# EAGLE design main (EAGLE 9.7.0)
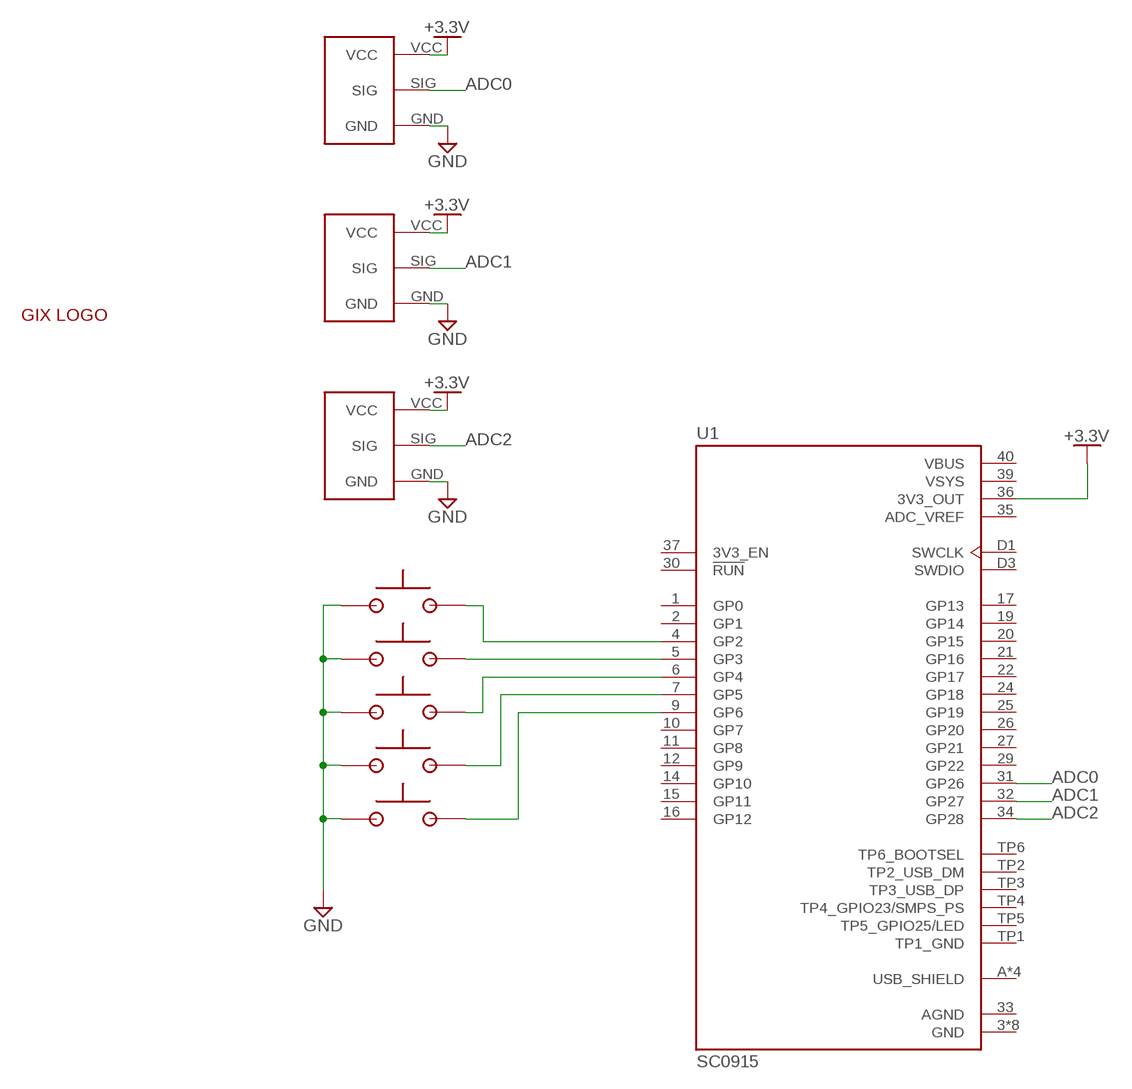
[diagram p0: schematic, sheet 1]

## Parts
U1  SC0915  [MODULE_SC0915]
U$1  TERMINAL_BLOCK  [TERMINAL_BLOCK]
U$2  TERMINAL_BLOCK  [TERMINAL_BLOCK]
U$3  TERMINAL_BLOCK  [TERMINAL_BLOCK]
U$4  TERMINAL_BLOCK  [TERMINAL_BLOCK]
U$5  TERMINAL_BLOCK  [TERMINAL_BLOCK]
U$6  3PIN_SENSOR  [TERMINAL_BLOCK_3P]
U$7  3PIN_SENSOR  [TERMINAL_BLOCK_3P]
U$8  3PIN_SENSOR  [TERMINAL_BLOCK_3P]
U$9  LOGO  [LOGO]

## Nets
+3.3V: U1.36(3V3_OUT) U$6.VCC U$7.VCC U$8.VCC
ADC0: U1.31(GP26) U$6.SIG
ADC1: U1.32(GP27) U$7.SIG
ADC2: U1.34(GP28) U$8.SIG
GND: U$1.P$1 U$2.P$1 U$3.P$1 U$4.P$1 U$5.P$1 U$6.GND U$7.GND U$8.GND
N$1: U1.6(GP4) U$3.P$2
N$2: U1.5(GP3) U$2.P$2
N$3: U1.4(GP2) U$1.P$2
N$4: U1.7(GP5) U$4.P$2
N$5: U1.9(GP6) U$5.P$2
Unconnected: U1.1(GP0) U1.2(GP1) U1.10(GP7) U1.11(GP8) U1.12(GP9) U1.14(GP10) U1.15(GP11) U1.16(GP12) U1.17(GP13) U1.19(GP14) U1.20(GP15) U1.21(GP16) U1.22(GP17) U1.24(GP18) U1.25(GP19) U1.26(GP20) U1.27(GP21) U1.29(GP22) U1.30(!RUN) U1.37(3V3_EN) U1.D1(SWCLK) U1.D3(SWDIO) U1.TP2(TP2_USB_DM) U1.TP3(TP3_USB_DP) U1.TP4(TP4_GPIO23/SMPS_PS) U1.TP5(TP5_GPIO25/LED) U1.TP6(TP6_BOOTSEL)

## Power pins joined to a net without a drawn wire
ADC_VREF: U1.35(ADC_VREF)
AGND: U1.33(AGND)
GND: U1.3(GND) U1.8(GND) U1.13(GND) U1.18(GND) U1.23(GND) U1.28(GND) U1.38(GND) U1.D2(GND)
TP1_GND: U1.TP1(TP1_GND)
USB_SHIELD: U1.A(USB_SHIELD) U1.B(USB_SHIELD) U1.C(USB_SHIELD) U1.D(USB_SHIELD)
VBUS: U1.40(VBUS)
VSYS: U1.39(VSYS)

## Library data of the parts
U1 = SC0915:SC0915; MANUFACTURER: Pi Supply; PARTREV: 1.9; SNAPEDA_PN: SC0915; STANDARD: Manufacturer Recommendations
U$1-U$5 = inputChallengeLib:TERMINAL_BLOCK
U$6-U$8 = inputChallengeLib:3PIN_SENSOR
U$9 = GIX:LOGO

## Board
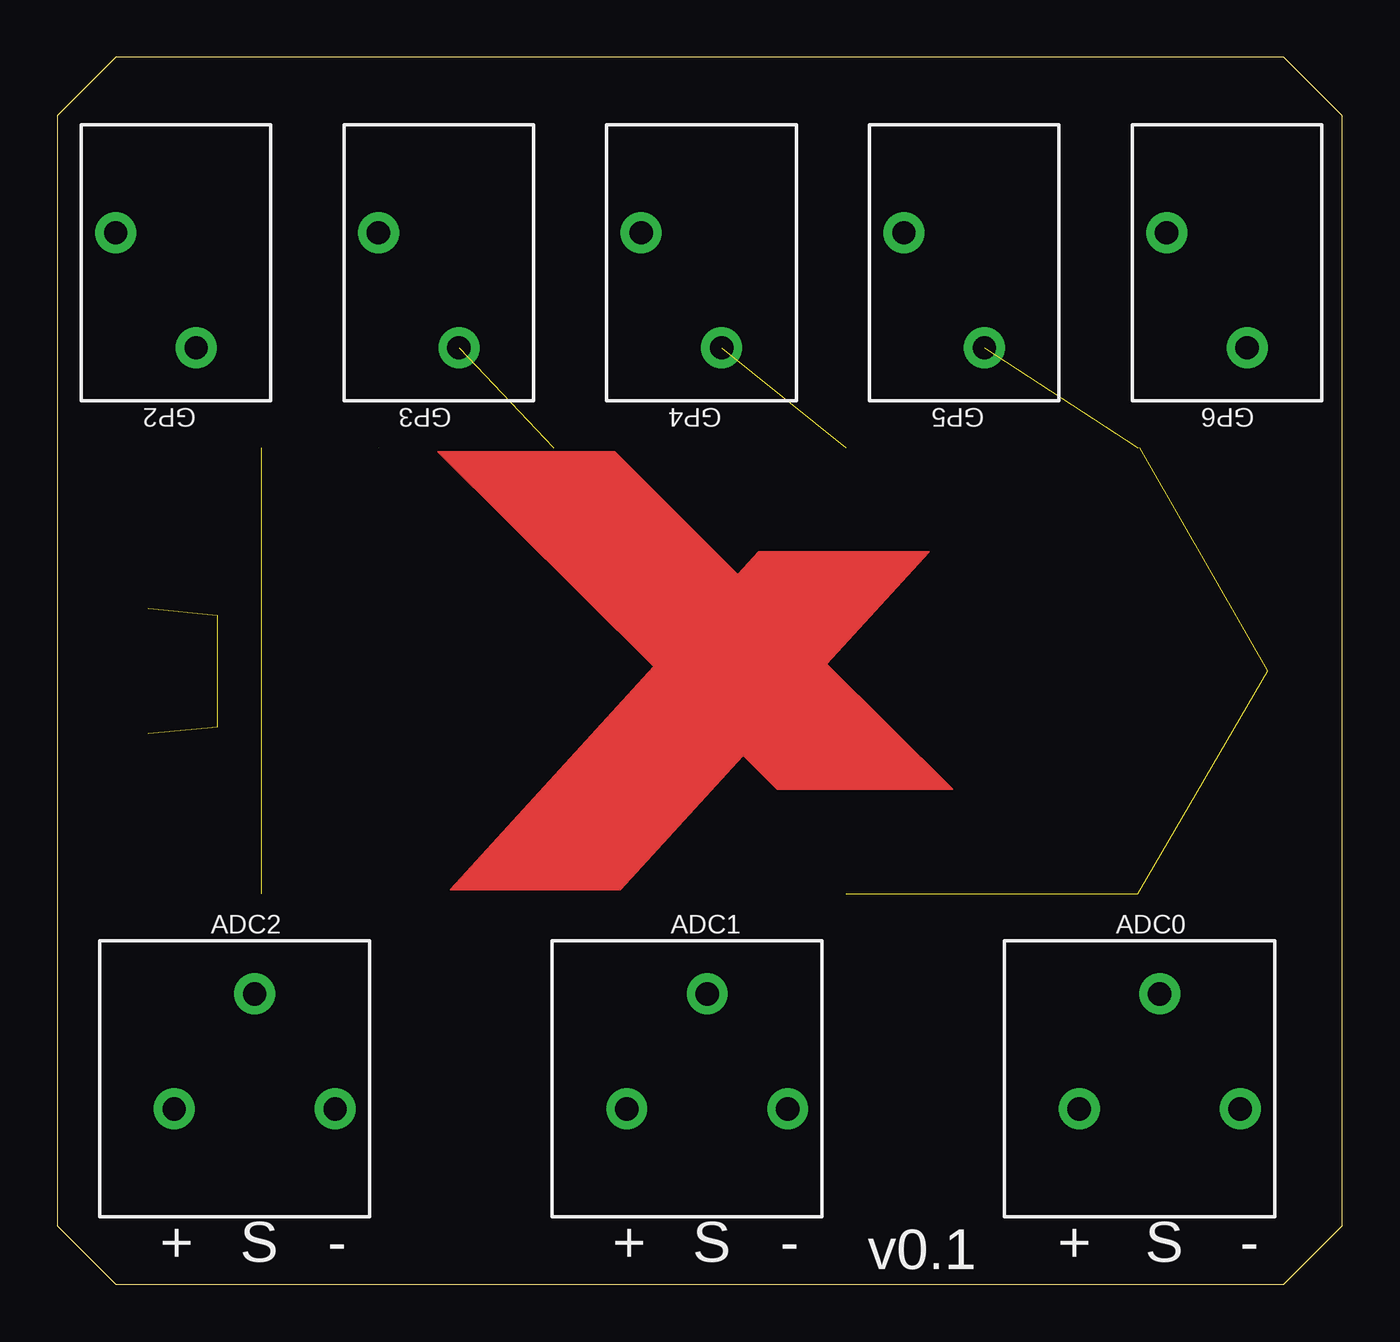
[diagram p1: board, top side]
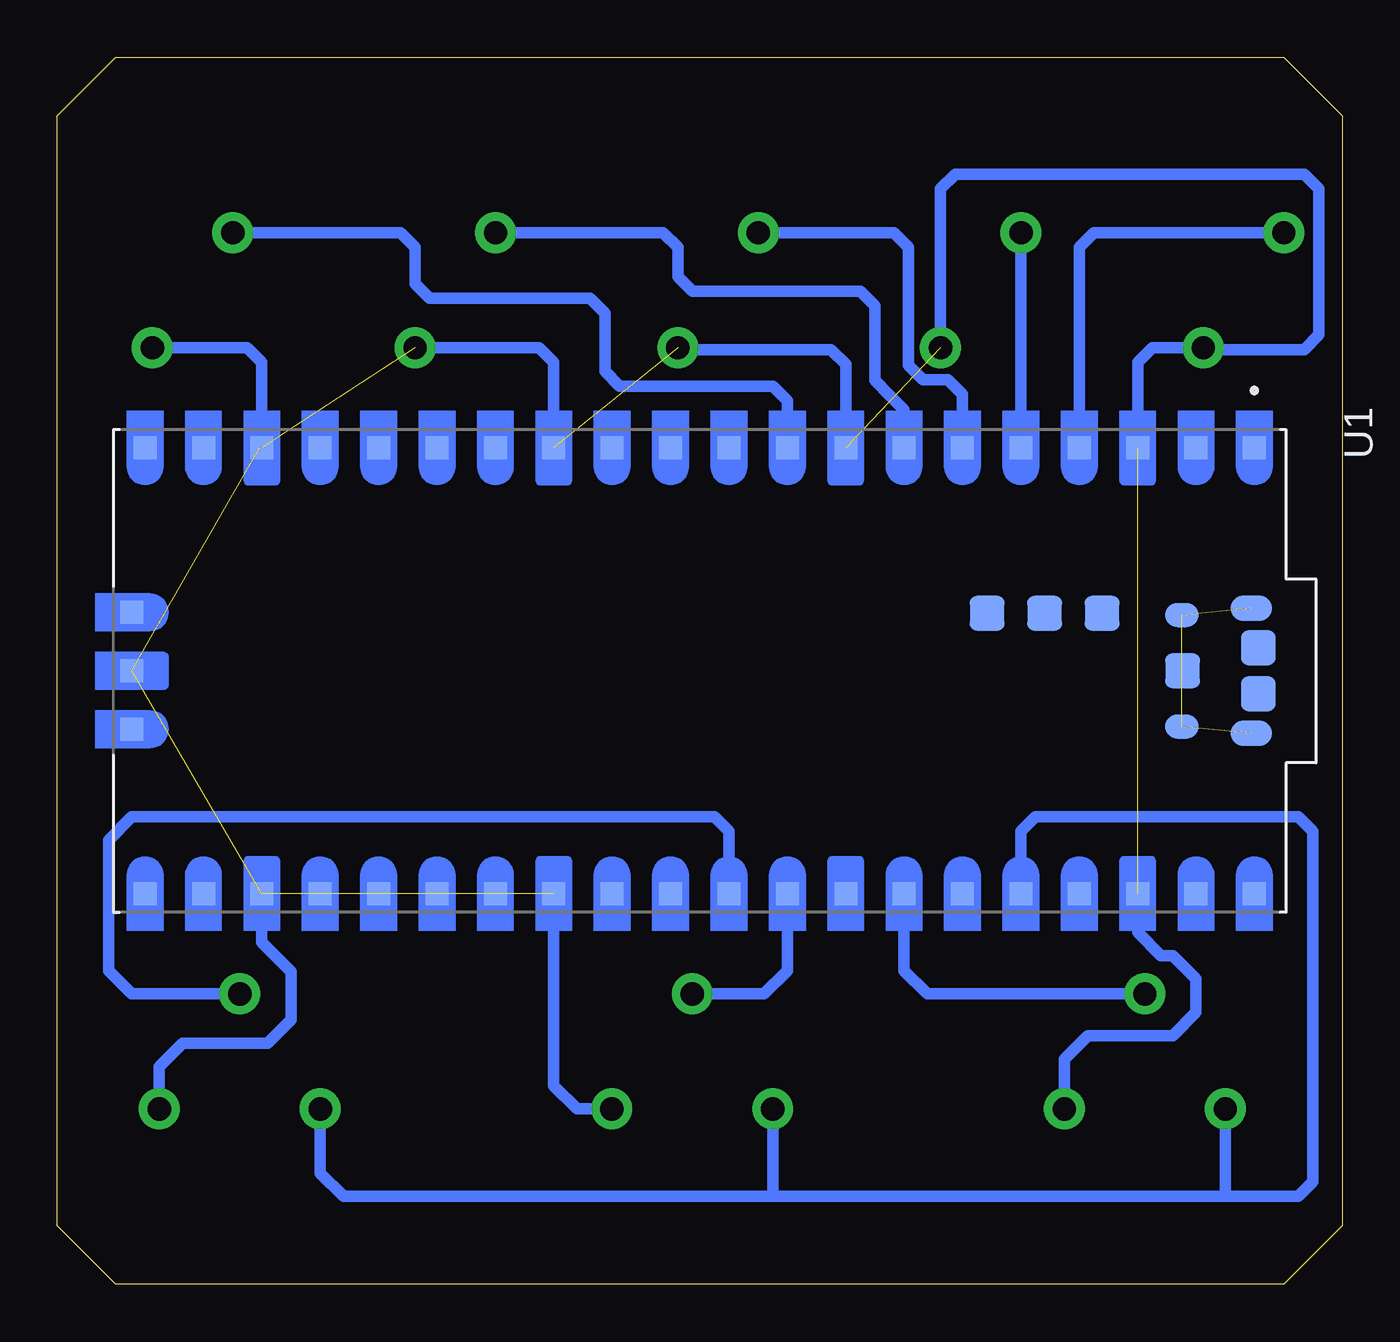
[diagram p2: board, bottom side, seen from below]

Size 55.88 x 53.34 mm. Coordinates in mm from the lower left corner, seen from the top.
Outline: 0,50.8 0,2.54 2.54,0 53.34,0 55.88,2.54 55.88,50.8 53.34,53.34 2.54,53.34 0,50.8
Copper layers (1*16): Top 0.035mm / dielectric 1.5mm / Bottom 0.035mm
Design rules "default": minimum track width 6mil, minimum drill 0.35mm, track to track 6mil, track to pad 6mil, pad to pad 6mil, via to via 6mil, smd to smd 6mil, copper to edge 40mil, drill to drill 6mil, minimum pad ring 10mil, minimum via ring 8mil, stop-mask expansion 4mil, vias tented up to drill 0mil, thermal gap 10mil

### Footprints (pad centres in the part's own frame; a part is rotated, then mirrored left to right if it is on the bottom)
MODULE_SC0915 = smd 1 x 1: 1 -9.69,24.13; 2 -9.69,21.59; 3 -9.69,19.05; 4 -9.69,16.51; 5 -9.69,13.97; 6 -9.69,11.43; 7 -9.69,8.89; 8 -9.69,6.35; 9 -9.69,3.81; 10 -9.69,1.27; 11 -9.69,-1.27; 12 -9.69,-3.81; 13 -9.69,-6.35; 14 -9.69,-8.89; 15 -9.69,-11.43; 16 -9.69,-13.97; 17 -9.69,-16.51; 18 -9.69,-19.05; 19 -9.69,-21.59; 20 -9.69,-24.13; 21 9.69,-24.13; 22 9.69,-21.59; 23 9.69,-19.05; 24 9.69,-16.51; 25 9.69,-13.97; 26 9.69,-11.43; 27 9.69,-8.89; 28 9.69,-6.35; 29 9.69,-3.81; 30 9.69,-1.27; 31 9.69,1.27; 32 9.69,3.81; 33 9.69,6.35; 34 9.69,8.89; 35 9.69,11.43; 36 9.69,13.97; 37 9.69,16.51; 38 9.69,19.05; 39 9.69,21.59; 40 9.69,24.13; D1 -2.54,-24.7; D2 0,-24.7; D3 2.54,-24.7 | smd 1.1 x 1.8: A -2.725,24; B 2.725,24 | smd 1.05 x 1.45: C -2.425,20.97; D 2.425,20.97 | smd 1.5 x 1.5: TP1 0,21; TP2 1,24.3; TP3 -1,24.3; TP4 -2.5,17.5; TP5 -2.5,15; TP6 -2.5,12.5
TERMINAL_BLOCK = drill 1.016 pad 1.778: P$1 0,5; P$2 3.5,0
TERMINAL_BLOCK_3P = drill 1.016 pad 1.778: GND 7,0; SIG 3.5,5; VCC 0,0

### Placement (x,y rotation side)
U1  27.94,26.67 270 bottom
U$1  6.03,45.72 180 top
U$2  17.46,45.72 180 top
U$3  28.89,45.72 180 top
U$4  40.32,45.72 180 top
U$5  51.75,45.72 180 top
U$6  44.45,7.62 0 top
U$7  24.77,7.62 0 top
U$8  5.08,7.62 0 top
U$9  16.51,17.14 0 top

### Tracks (layer width: path | path; a pad name or v marks a point on that pad's centre or on a via)
+3.3V
  Bottom 0.508: U1.36 13.97,19.68 13.34,20.32 1.91,20.32 1.27,19.68 1.27,4.45 1.91,3.81 5.08,3.81 | 5.08,3.81 24.77,3.81 | 24.77,3.81 43.43,3.81 44.45,4.83 U$6.VCC | U$7.VCC 24.77,3.81 | U$8.VCC 5.08,3.81
ADC0
  Bottom 0.508: U1.31 26.67,19.68 27.3,20.32 52.64,20.32 53.66,19.3 53.66,13.64 52.64,12.62 U$6.SIG
ADC1
  Bottom 0.508: U$7.SIG 25.15,12.62 24.13,13.64 U1.32
ADC2
  Bottom 0.508: U$8.SIG 18.03,12.62 19.05,13.64 U1.34
GND  (8 unrouted)
  Bottom 0.508: U$3.P$1 28.89,40.64 22.23,40.64 21.59,40.01 U1.8 | U$4.P$1 34.92,40.72 34.29,40.09 U1.13 | U$1.P$1 6.03,40.39 | U$2.P$1 17.46,47.62 16.83,48.26 1.65,48.26 1.02,47.62 1.02,41.27 1.65,40.64 6.03,40.64 U$1.P$1 | 47.08,36.36 U1.18 46.99,40.09 47.62,40.72 U$5.P$1 | 46.99,15.81 U1.23 46.99,14.86 46.74,14.61 45.72,13.59 45.72,11.49 46.74,10.48 50.43,10.48 51.45,9.46 U$6.GND | U$1.P$1 8.26,40.72 8.89,40.09 U1.3 | U$8.GND 12.08,9.78 11.06,10.79 7.37,10.79 6.35,11.81 6.35,13.27 7.37,14.29 7.87,14.29 8.89,15.3 8.89,17.78 | U$7.GND 33.27,7.62 34.29,8.64 U1.28
N$1
  Bottom 0.508: U$3.P$2 19.49,45.72 18.86,45.09 18.86,39.96 18.22,39.32 17.14,39.32 16.51,38.69 U1.6
N$2  (1 unrouted)
  Bottom 0.508: U$2.P$2 U1.5
N$3
  Bottom 0.508: U$1.P$2 10.79,45.72 11.43,45.09 U1.4
N$4
  Bottom 0.508: U$4.P$2 29.53,45.72 28.89,45.09 28.89,43.81 28.26,43.18 20.95,43.18 20.32,42.55 20.32,39.3 19.68,38.66 19.05,38.03 U1.7
N$5
  Bottom 0.508: U$5.P$2 40.96,45.72 40.32,45.09 40.32,43.5 39.69,42.86 32.7,42.86 32.07,42.23 32.07,39.69 31.43,39.05 24.77,39.05 24.13,38.42 U1.9
USB_SHIELD  (3 unrouted)

### Text on the board
tPlace: GP2 | GP3 | GP4 | GP5 | GP6 | ADC2 | ADC1 | ADC0 | + | S | - | + | S | - | v0.1 | + | S | -